# EAGLE design pH_meter (EAGLE 9.6.2)

## Sheet 1 of 2
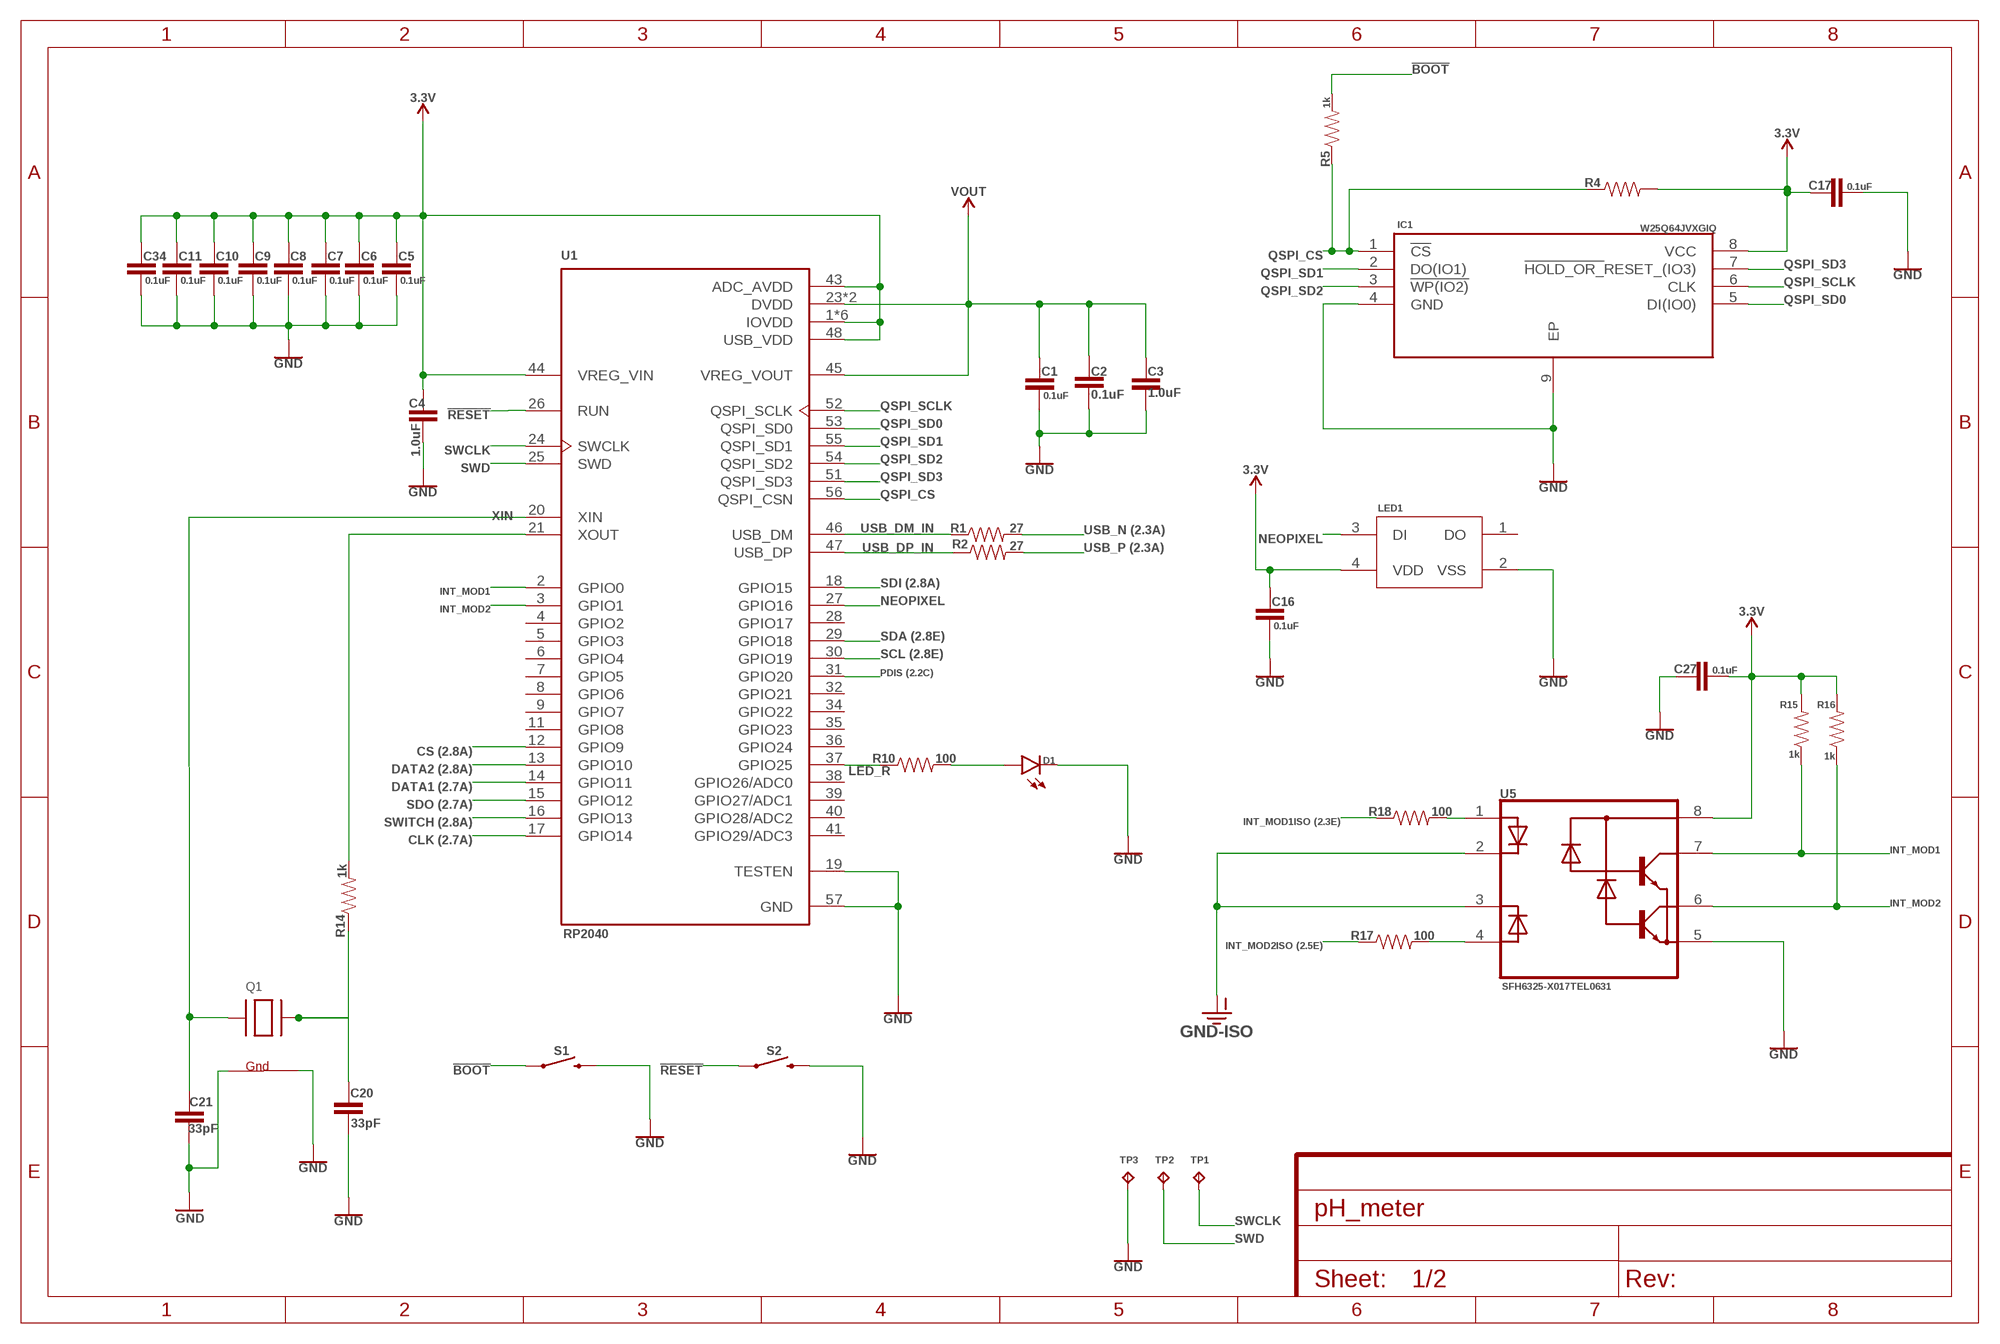
[diagram p0: schematic, sheet 1]

### Parts
C1  0.1uF  0.1UF-0603-25V-(+80/-20%)  [0603]
C2  0.1uF  0.1UF-0603-25V-(+80/-20%)  [0603]
C3  1.0uF  1.0UF-0603-16V-10%  [0603]
C4  1.0uF  1.0UF-0603-16V-10%  [0603]
C5  0.1uF  0.1UF-0603-25V-(+80/-20%)  [0603]
C6  0.1uF  0.1UF-0603-25V-(+80/-20%)  [0603]
C7  0.1uF  0.1UF-0603-25V-(+80/-20%)  [0603]
C8  0.1uF  0.1UF-0603-25V-(+80/-20%)  [0603]
C9  0.1uF  0.1UF-0603-25V-(+80/-20%)  [0603]
C10  0.1uF  0.1UF-0603-25V-(+80/-20%)  [0603]
C11  0.1uF  0.1UF-0603-25V-(+80/-20%)  [0603]
C16  0.1uF  0.1UF-0603-25V-(+80/-20%)  [0603]
C17  0.1uF  0.1UF-0603-25V-(+80/-20%)  [0603]
C20  33pF  33PF-0603-50V-5%  [0603]
C21  33pF  33PF-0603-50V-5%  [0603]
C27  0.1uF  0.1UF-0603-25V-(+80/-20%)  [0603]
C34  0.1uF  0.1UF-0603-25V-(+80/-20%)  [0603]
D1  LED0603  [LED-0603]
IC1  W25Q64JVXGIQ  [SON80P400X400X50-9N]
LED1  WS2812B-2020  [WS2812B-2020]
Q1  XTAL-4-3225  [NX3225]
R1  27  27OHM-0603-1/10W-1%  [0603]
R2  27  27OHM-0603-1/10W-1%  [0603]
R4  RESISTOR0603  [0603]
R5  1k  1KOHM-0603-1/10W-1%  [0603]
R10  100  100OHM-0603-1/10W-1%  [0603]
R14  1k  1KOHM-0603-1/10W-1%  [0603]
R15  1k  1KOHM-0603-1/10W-1%  [0603]
R16  1k  1KOHM-0603-1/10W-1%  [0603]
R17  100  100OHM-0603-1/10W-1%  [0603]
R18  100  100OHM-0603-1/10W-1%  [0603]
S1  MOMENTARY-SWITCH-SPST-SMD-4.6X2.8MM  [TACTILE_SWITCH_SMD_4.6X2.8MM]
S2  MOMENTARY-SWITCH-SPST-SMD-4.6X2.8MM  [TACTILE_SWITCH_SMD_4.6X2.8MM]
TP1  TPB2,54  [B2,54]
TP2  TPB2,54  [B2,54]
TP3  TPB2,54  [B2,54]
U1  RP2040  [QFN40P700X700X90-57N]
U5  SFH6325-X017TEL0631  [SOIC127P599X175-8N]

### Nets
3.3V: C4.1 C5.1 C6.1 C7.1 C8.1 C9.1 C10.1 C11.1 C16.1 C17.1 C27.2 C34.1 IC1.8(VCC) LED1.4(VDD) R4.2 R15.2 R16.2 U1.1(IOVDD) U1.10(IOVDD) U1.22(IOVDD) U1.33(IOVDD) U1.42(IOVDD) U1.43(ADC_AVDD) U1.44(VREG_VIN) U1.48(USB_VDD) U1.49(IOVDD) U5.8(C(VCC)) ; also sheet 2
!BOOT: R5.2 S1.1 S1.2
!RESET: S2.1 S2.2 U1.26(RUN)
CLK: U1.17(GPIO14) ; also sheet 2
CS: U1.12(GPIO9) ; also sheet 2
DATA1: U1.14(GPIO11) ; also sheet 2
DATA2: U1.13(GPIO10) ; also sheet 2
GND: C1.2 C2.2 C3.2 C4.2 C5.2 C6.2 C7.2 C8.2 C9.2 C10.2 C11.2 C16.2 C17.2 C20.1 C21.1 C27.1 C34.2 D1.C IC1.4(GND) IC1.9(EP) LED1.2(VSS) Q1.2(G2) Q1.4(G1) S1.3 S1.4 S2.3 S2.4 TP3.TP U1.19(TESTEN) U1.57(GND) U5.5(E(GND)) ; also sheet 2
GND-ISO: U5.2(C1) U5.3(C2) ; also sheet 2
INT_MOD1: R15.1 U1.2(GPIO0) U5.7(C1(VO1))
INT_MOD1ISO: R18.1 ; also sheet 2
INT_MOD2: R16.1 U1.3(GPIO1) U5.6(C2(VO2))
INT_MOD2ISO: R17.1 ; also sheet 2
LED_R: R10.1 U1.37(GPIO25)
N$1: D1.A R10.2
N$4: C20.2 Q1.3(X2) R14.1
N$6: R14.2 U1.21(XOUT)
N$7: R17.2 U5.4(A2)
N$8: R18.2 U5.1(A1)
NEOPIXEL: LED1.3(DI) U1.27(GPIO16)
PDIS: U1.31(GPIO20) ; also sheet 2
QSPI_CS: IC1.1(!CS) R4.1 R5.1 U1.56(QSPI_CSN)
QSPI_SCLK: IC1.6(CLK) U1.52(QSPI_SCLK)
QSPI_SD0: IC1.5(DI(IO0)) U1.53(QSPI_SD0)
QSPI_SD1: IC1.2(DO(IO1)) U1.55(QSPI_SD1)
QSPI_SD2: IC1.3(!WP(IO2)) U1.54(QSPI_SD2)
QSPI_SD3: IC1.7(!HOLD_OR_!RESET_(IO3)) U1.51(QSPI_SD3)
SCL: U1.30(GPIO19) ; also sheet 2
SDA: U1.29(GPIO18) ; also sheet 2
SDI: U1.18(GPIO15) ; also sheet 2
SDO: U1.15(GPIO12) ; also sheet 2
SWCLK: TP1.TP U1.24(SWCLK)
SWD: TP2.TP U1.25(SWD)
SWITCH: U1.16(GPIO13) ; also sheet 2
USB_DM_IN [USB]: R1.1 U1.46(USB_DM)
USB_DP_IN [USB]: R2.1 U1.47(USB_DP)
USB_N [USB]: R1.2 ; also sheet 2
USB_P [USB]: R2.2 ; also sheet 2
VOUT: C1.1 C2.1 C3.1 U1.23(DVDD) U1.45(VREG_VOUT) U1.50(DVDD)
XIN: C21.2 Q1.1(X1) U1.20(XIN)
Unconnected: LED1.1(DO) U1.4(GPIO2) U1.5(GPIO3) U1.6(GPIO4) U1.7(GPIO5) U1.8(GPIO6) U1.9(GPIO7) U1.11(GPIO8) U1.28(GPIO17) U1.32(GPIO21) U1.34(GPIO22) U1.35(GPIO23) U1.36(GPIO24) U1.38(GPIO26/ADC0) U1.39(GPIO27/ADC1) U1.40(GPIO28/ADC2) U1.41(GPIO29/ADC3)

## Sheet 2 of 2
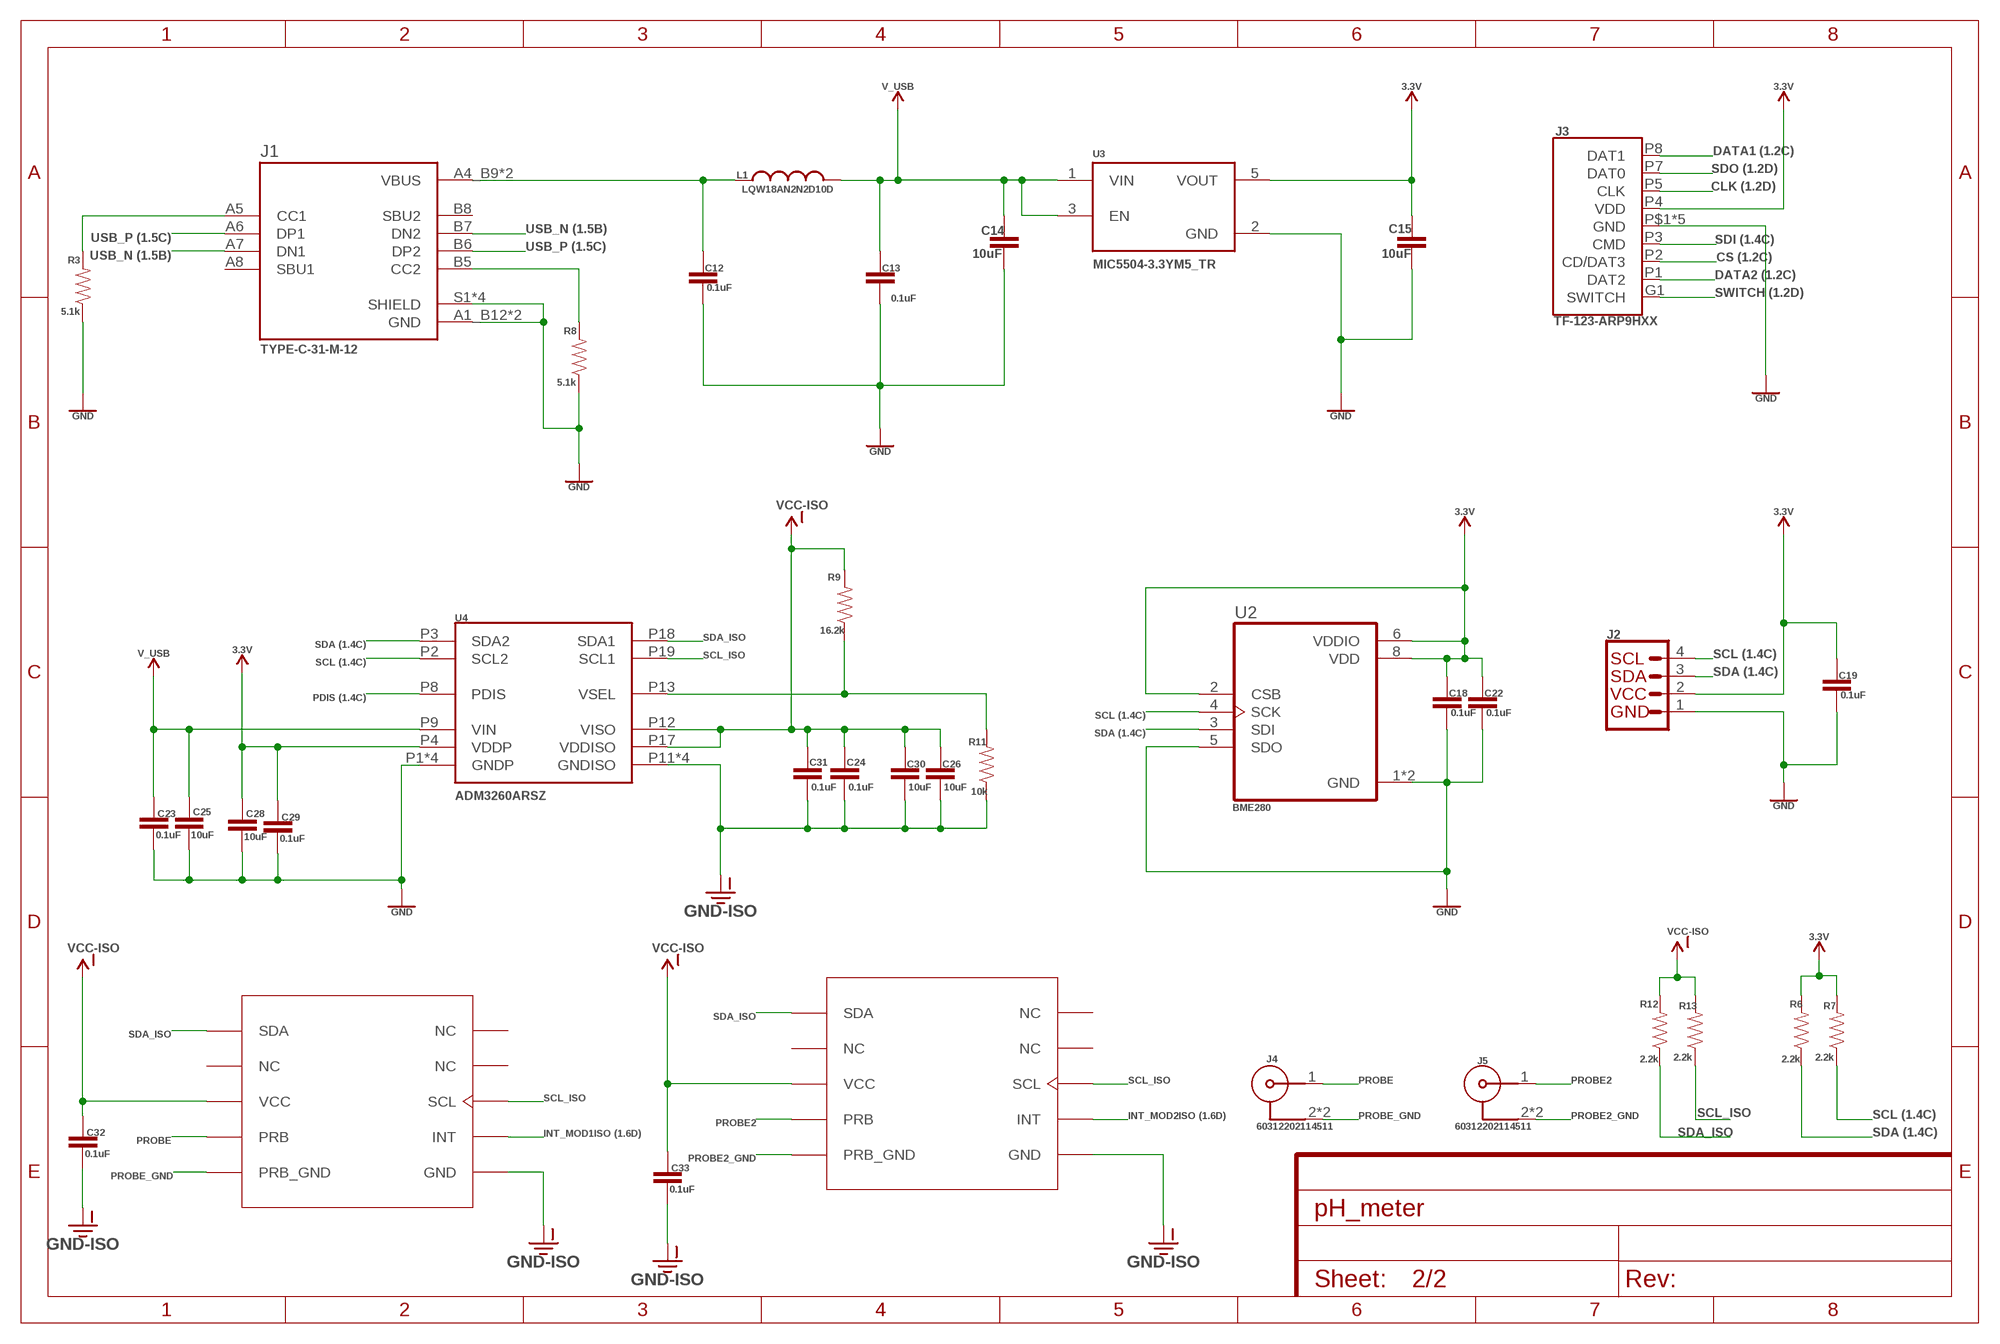
[diagram p1: schematic, sheet 2]

### Parts
C12  0.1uF  0.1UF-0603-25V-(+80/-20%)  [0603]
C13  0.1uF  0.1UF-0603-25V-(+80/-20%)  [0603]
C14  10uF  10UF-0603-6.3V-20%  [0603]
C15  10uF  10UF-0603-6.3V-20%  [0603]
C18  0.1uF  0.1UF-0603-25V-5%  [0603]
C19  0.1uF  0.1UF-0603-25V-5%  [0603]
C22  0.1uF  0.1UF-0603-25V-5%  [0603]
C23  0.1uF  0.1UF-0603-25V-5%  [0603]
C24  0.1uF  0.1UF-0603-50V-10%-X7R-WE  [0603]
C25  10uF  10UF-0603-6.3V-20%  [0603]
C26  10uF  10UF-0603-6.3V-20%  [0603]
C28  10uF  10UF-0603-6.3V-20%  [0603]
C29  0.1uF  0.1UF-0603-25V-5%  [0603]
C30  10uF  10UF-0603-6.3V-20%  [0603]
C31  0.1uF  0.1UF-0603-50V-10%-X7R-WE  [0603]
C32  0.1uF  0.1UF-0603-25V-5%  [0603]
C33  0.1uF  0.1UF-0603-25V-5%  [0603]
J1  TYPE-C-31-M-12  [HRO_TYPE-C-31-M-12]
J2  QWIIC_CONNECTORJS-1MM  [1X04_1MM_RA]
J3  TF-123-ARP9HXX  [MICROSDCARD]
J4  60312202114511  [60312202114511]
J5  60312202114511  [60312202114511]
L1  LQW18AN2N2D10D  [INDC1608X100N]
R3  5.1k  5.1KOHM5.1KOHM-0603-1/10W-1%  [0603]
R6  2.2k  2.2KOHM-0603-1/10W-1%  [0603]
R7  2.2k  2.2KOHM-0603-1/10W-1%  [0603]
R8  5.1k  5.1KOHM5.1KOHM-0603-1/10W-1%  [0603]
R9  16.2k  16.2KOHM-0603-1/10W-1%  [0603]
R11  10k  10KOHM-0603-1/10W-1%  [0603]
R12  2.2k  2.2KOHM-0603-1/10W-1%  [0603]
R13  2.2k  2.2KOHM-0603-1/10W-1%  [0603]
U2  BME280  [PSON65P250X250X100-8N]
U3  MIC5504-3.3YM5_TR  [SOT95P280X145-5N]
U4  ADM3260ARSZ  [SSOP20]
U$1  PH-OEM  [PH_SENSOR]
U$2  PH-OEM  [PH_SENSOR]

### Nets
3.3V: C15.2 C18.1 C19.1 C22.1 C28.1 C29.1 J2.2 J3.P4(VDD) R6.2 R7.2 U2.2(CSB) U2.6(VDDIO) U2.8(VDD) U3.5(VOUT) U4.P4(VDDP) ; also sheet 1
CLK: J3.P5(CLK) ; also sheet 1
CS: J3.P2(CD/DAT3) ; also sheet 1
DATA1: J3.P8(DAT1) ; also sheet 1
DATA2: J3.P1(DAT2) ; also sheet 1
GND: C12.2 C13.2 C14.1 C15.1 C18.2 C19.2 C22.2 C23.2 C25.2 C28.2 C29.2 J1.A1_B12(GND) J1.B1_A12(GND) J1.S1(SHIELD) J1.S2(SHIELD) J1.S3(SHIELD) J1.S4(SHIELD) J2.1 J3.P6(GND) J3.P$1(GND) J3.P$2(GND) J3.P$3(GND) J3.P$4(GND) R3.1 R8.1 U2.1(GND) U2.5(SDO) U2.7(GND) U3.2(GND) U4.P1(GNDP) U4.P5(GNDP) U4.P7(GNDP) U4.P10(GNDP) ; also sheet 1
GND-ISO: C24.2 C26.2 C30.2 C31.2 C32.2 C33.2 R11.1 U4.P11(GNDISO) U4.P14(GNDISO) U4.P16(GNDISO) U4.P20(GNDISO) U$1.P$6(GND) U$2.P$6(GND) ; also sheet 1
INT_MOD1ISO: U$2.P$7(INT) ; also sheet 1
INT_MOD2ISO: U$1.P$7(INT) ; also sheet 1
N$2: R9.1 R11.2 U4.P13(VSEL)
N$3: J1.A5(CC1) R3.2
N$5: J1.B5(CC2) R8.2
N$9: C12.1 J1.A4_B9(VBUS) J1.B4_A9(VBUS) L1.1
PDIS: U4.P8(PDIS) ; also sheet 1
PROBE: J4.1 U$2.P$4(PRB)
PROBE2: J5.1 U$1.P$4(PRB)
PROBE2_GND: J5.2 J5.3 U$1.P$5(PRB_GND)
PROBE_GND: J4.2 J4.3 U$2.P$5(PRB_GND)
SCL: J2.4 R7.1 U2.4(SCK) U4.P2(SCL2) ; also sheet 1
SCL_ISO: R13.1 U4.P19(SCL1) U$1.P$8(SCL) U$2.P$8(SCL)
SDA: J2.3 R6.1 U2.3(SDI) U4.P3(SDA2) ; also sheet 1
SDA_ISO: R12.1 U4.P18(SDA1) U$1.P$1(SDA) U$2.P$1(SDA)
SDI: J3.P3(CMD) ; also sheet 1
SDO: J3.P7(DAT0) ; also sheet 1
SWITCH: J3.G1(SWITCH) ; also sheet 1
USB_N [USB]: J1.A7(DN1) J1.B7(DN2) ; also sheet 1
USB_P [USB]: J1.A6(DP1) J1.B6(DP2) ; also sheet 1
V_USB: C13.1 C14.2 C23.1 C25.1 L1.2 U3.1(VIN) U3.3(EN) U4.P9(VIN)
VCC-ISO: C24.1 C26.1 C30.1 C31.1 C32.1 C33.1 R9.2 R12.2 R13.2 U4.P12(VISO) U4.P17(VDDISO) U$1.P$3(VCC) U$2.P$3(VCC)
Unconnected: J1.A8(SBU1) J1.B8(SBU2) U$1.P$2(NC) U$1.P$9(NC) U$1.P$10(NC) U$2.P$2(NC) U$2.P$9(NC) U$2.P$10(NC)

## Library data of the parts
C1 C2 C5-C13 C16 C17 C27 C34 = SparkFun-Capacitors:0.1UF: 0.1µF ceramic capacitors A capacitor is a passive two-terminal electrical component used to store electrical energy temporarily in an electric field.; PROD_ID: CAP-00810
C3 C4 = SparkFun-Capacitors:1.0UF: 1µF ceramic capacitors A capacitor is a passive two-terminal electrical component used to store electrical energy temporarily in an electric field.; PROD_ID: CAP-00868
C14 C15 C25 C26 C28 C30 = SparkFun-Capacitors:10UF: 10.0µF ceramic capacitors A capacitor is a passive two-terminal electrical component used to store electrical energy temporarily in an electric field.; PROD_ID: CAP-11015
C18 C19 C22 C23 C29 C32 C33 = SparkFun-Capacitors:0.1UF: 0.1µF ceramic capacitors A capacitor is a passive two-terminal electrical component used to store electrical energy temporarily in an electric field.; PROD_ID: CAP-08604
C20 C21 = SparkFun-Capacitors:33PF: 33pF ceramic capacitors A capacitor is a passive two-terminal electrical component used to store electrical energy temporarily in an electric field.; PROD_ID: CAP-10142
C24 C31 = SparkFun-Capacitors:0.1UF: 0.1µF ceramic capacitors A capacitor is a passive two-terminal electrical component used to store electrical energy temporarily in an electric field.; PROD_ID: CAP-16523
D1 = SparkFun-LED:LED: LED (Generic) Standard schematic elements and footprints for 5mm, 3mm, 1206, and 0603 sized LEDs. Generic LEDs with no color specified.
IC1 = SamacSys_Parts:W25Q64JVXGIQ: 64M-bit Serial Flash Memory with uniform 4KB sectors and Dual/Quad SPI Source: Datasheet <https://www.winbond.com/hq/search-resource-file.jsp?partNo=W25Q64JVXGIQ&type=datasheet>; DESCRIPTION: 64M-bit Serial Flash Memory with uniform 4KB sectors and Dual/Quad SPI; HEIGHT: 0.5mm; MANUFACTURER_NAME: Winbond; MANUFACTURER_PART_NUMBER: W25Q64JVXGIQ
J1 = TYPE-C-31-M-12:TYPE-C-31-M-12: Check availability <https://pricing.snapeda.com/parts/TYPE-C-31-M-12/HRO%20Electronics%20Co.%2C%20Ltd./view-part?ref=eda>; AVAILABILITY: Not in stock; CHECK_PRICES: https://www.snapeda.com/parts/TYPE-C-31-M-12/HRO+Electronics+Co.%252C+Ltd./view-part/?ref=eda; DESCRIPTION: USB Connectors 24 Receptacle 1 8.94*7.3mm RoHS; MF: HRO Electronics Co., Ltd.; MP: TYPE-C-31-M-12; PACKAGE: Package; PRICE: None; SNAPEDA_LINK: https://www.snapeda.com/parts/TYPE-C-31-M-12/HRO+Electronics+Co.%252C+Ltd./view-part/?ref=snap
J2 = SparkFun-Connectors:QWIIC_CONNECTOR: SparkFun I2C Standard Qwiic Connector An SMD 1mm pitch JST connector makes it easy and quick (get it? Qwiic?) to connect I2C devices to each other. The Qwiic system <http://www.sparkfun.com/qwiic> enables fast and solderless connection between popular platforms and various sensors and actuators. We carry 200mm <https://www.sparkfun.com/products/14204>, 100mm <https://www.sparkfun.com/products/14205>, 50mm <https://www.sparkfun.com/products/14206>, and breadboard friendly <https://www.sparkfun.com/products/14207> Qwiic cables. We also offer 10 pcs strips <https://www.sparkfun.com/products/14323> the SMD connectors.; PROD_ID: CONN-13694
J3 = xunpu_tf123:TF-123-ARP9HXX
J4 J5 = 60312202114511:60312202114511: WR-SMA PCB End Launch Characteristics Interface: MIL-STD-348 Mating Cycle: 500 Cycles Impedance: 50Ω Insulation Resistance: 5000MΩ(min.) Withstanding Voltage: 1000Vrms(min.) Ingress Protection: None l IP67 Mating: Screw (Recommended by torque wrench tool) Applications Network and communications RF Test and measurement equipment Industrial applications Electronic consumers and device Outdoor or humid environment <https://www.we-online.com/components/media/o122886v209%20Family-WR-SMA%20End%20Launch%20Connectors.jpg> Details see: www.we-online.com/components/products/COAX_SMA_CONNECTOR_PCB_END_LAUNCH <www.we-online.com/catalog/COAX_SMA_CONNECTOR_PCB_END_LAUNCH/?utm_source=eagle_model&utm_medium=description_link&utm_campaign=eisos_eagle> Updated by Ella Wu 2023-10-10 2023(C) Würth Elektronik Check availability <https://pricing.snapeda.com/parts/60312202114511/Wurth%20Electronics/view-part?ref=eda>; AVAILABILITY: In Stock; CHECK_PRICES: https://www.snapeda.com/parts/60312202114511/Wurth+Electronics+Inc./view-part/?ref=eda; DESCRIPTION: SMA Connector Jack, Female Socket 50Ohm Board Edge, End Launch; Through Hole, Right Angle Solder; MF: Wurth Electronics; MP: 60312202114511; PACKAGE: None; PRICE: None; PURCHASE-URL: https://www.snapeda.com/api/url_track_click_mouser/?unipart_id=3995265&manufacturer=Wurth Electronics&part_name=60312202114511&search_term=60312202114511; SNAPEDA_LINK: https://www.snapeda.com/parts/60312202114511/Wurth+Electronics+Inc./view-part/?ref=snap
L1 = LQW18AN2N2D10D:LQW18AN2N2D10D: Inductor RF Chip Unshielded Wirewound 2.2nH 0.5nH 100MHz 25Q-Factor Ceramic 1.4A 18mOhm DCR 0603 T/R Check availability <https://pricing.snapeda.com/parts/LQW18AN2N2D10D/Murata/view-part?ref=eda>; AVAILABILITY: In Stock; CHECK_PRICES: https://www.snapeda.com/parts/LQW18AN2N2D10D/Murata/view-part/?ref=eda; DESCRIPTION: Inductor with Inductance: 2.2nH Tol. +/-0.5nH, Package: 0603 (1608); MF: Murata; MP: LQW18AN2N2D10D; PACKAGE: 1608 Murata; PRICE: None; PURCHASE-URL: https://www.snapeda.com/api/url_track_click_mouser/?unipart_id=1503005&manufacturer=Murata&part_name=LQW18AN2N2D10D&search_term=2.2nh 0603; SNAPEDA_LINK: https://www.snapeda.com/parts/LQW18AN2N2D10D/Murata/view-part/?ref=snap
LED1 = WS2812B-2020:WS2812B-2020: A small 2x2mm addressable RGB led Check availability <https://pricing.snapeda.com/parts/WS2812B-2020/WorldSemi/view-part?ref=eda>; AVAILABILITY: Not in stock; DESCRIPTION: Programmable LED; SMD; 2020; RGB; 2x2x0.84mm; 3.7÷5.3V; 2kHz; MF: WorldSemi; MP: WS2812B-2020; PACKAGE: None; PRICE: None
Q1 = adafruit:XTAL-4: Classic 4-pin 3.2 x 2.5mm crystal
R1 R2 = SparkFun-Resistors:27OHM: 27Ω resistor A resistor is a passive two-terminal electrical component that implements electrical resistance as a circuit element. Resistors act to reduce current flow, and, at the same time, act to lower voltage levels within circuits. - Wikipedia; PROD_ID: RES-09334
R3 R8 = SparkFun-Resistors:5.1KOHM; PROD_ID: RES-12083
R4 = SparkFun-Resistors:RESISTOR: Generic Resistor Package
R5 R14-R16 = SparkFun-Resistors:1KOHM: 1kΩ resistor A resistor is a passive two-terminal electrical component that implements electrical resistance as a circuit element. Resistors act to reduce current flow, and, at the same time, act to lower voltage levels within circuits. - Wikipedia; PROD_ID: RES-07856
R6 R7 R12 R13 = SparkFun-Resistors:2.2KOHM: 2.2kΩ resistor A resistor is a passive two-terminal electrical component that implements electrical resistance as a circuit element. Resistors act to reduce current flow, and, at the same time, act to lower voltage levels within circuits. - Wikipedia; PROD_ID: RES-08272
R9 = SparkFun-Resistors:16.2KOHM: 16.2kΩ resistor A resistor is a passive two-terminal electrical component that implements electrical resistance as a circuit element. Resistors act to reduce current flow, and, at the same time, act to lower voltage levels within circuits. - Wikipedia; PROD_ID: RES-12187
R10 R17 R18 = SparkFun-Resistors:100OHM: 100Ω resistor A resistor is a passive two-terminal electrical component that implements electrical resistance as a circuit element. Resistors act to reduce current flow, and, at the same time, act to lower voltage levels within circuits. - Wikipedia; PROD_ID: RES-07863
R11 = SparkFun-Resistors:10KOHM: 10kΩ resistor A resistor is a passive two-terminal electrical component that implements electrical resistance as a circuit element. Resistors act to reduce current flow, and, at the same time, act to lower voltage levels within circuits. - Wikipedia; PROD_ID: RES-00824
S1 S2 = SparkFun-Switches:MOMENTARY-SWITCH-SPST: Momentary Switch (Pushbutton) - SPST Normally-open (NO) SPST momentary switches (buttons, pushbuttons). Variants PTH-12MM - 12mm square, through-hole Momentary Pushbutton Switch - 12mm Square <https://www.sparkfun.com/products/9190> (COM-09190) PTH-6.0MM, PTH-6.0MM-KIT - 6.0mm square, through-hole Mini Pushbutton Switch <https://www.sparkfun.com/products/97> (COM-00097) KIT package intended for soldering kit's - only one side of pads' copper is exposed. PTH-RIGHT-ANGLE-KIT - Right-angle, through-hole Right Angle Tactile Button <https://www.sparkfun.com/products/10791> - Used on SparkFun BigTime Watch Kit <https://www.sparkfun.com/products/11734> SMD-12MM - 12mm square, surface-mount Tactile Button - SMD (12mm) <https://www.sparkfun.com/products/12993> (COM-12993) Used on SparkFun PicoBoard <https://www.sparkfun.com/products/11888> SMD-4.5MM - 4.5mm Square Trackball Switch Used on SparkFun Blackberry Trackballer Breakout <https://www.sparkfun.com/products/13169> SMD-4.6MMX2.8MM - 4.60mm x 2.80mm, surface mount Used on SparkFun SAMD21 Mini Breakout <https://www.sparkfun.com/products/13664> SMD-5.2MM, SMD-5.2-REDUNDANT - 5.2mm square, surface-mount Mini Pushbutton Switch - SMD <https://www.sparkfun.com/products/8720> (COM-08720) Used on Arduino Pro Mini <https://www.sparkfun.com/products/11114> REDUNDANT package connects both switch circuits together SMD-6.0X3.5MM - 6.0 x 3.5mm, surface mount Momentary Reset Switch SMD <https://www.sparkfun.com/products/8229> (COM-08229) SMD-6.2MM-TALL - 6.2mm square, surface mount Tactile Button - SMD (6mm) <https://www.sparkfun.com/products/12992> Used on SparkFun Digital Sandbox <https://www.sparkfun.com/products/12651> SMD-RIGHT-ANGLE - Right-angle, surface mount Used on SparkFun Block for Intel® Edison - Arduino <https://www.sparkfun.com/products/13036>; PROD_ID: SWCH-13065
TP1-TP3 = testpad:TP: Test pad
U1 = RP2040:RP2040: Check availability <https://pricing.snapeda.com/parts/RP2040/Raspberry%20Pi/view-part?ref=eda>; AVAILABILITY: In Stock; DESCRIPTION: RP2040 chip for Raspberry Pi Pico - ARM® Cortex®-M0+ MCU 32-Bit; MF: Raspberry Pi; MP: RP2040; PACKAGE: None; PRICE: None; PURCHASE-URL: https://pricing.snapeda.com/search/part/RP2040/?ref=eda
U2 = BME280:BME280: DIGITAL HUMIDITY, PRESSURE AND TEMPERATURE SENSOR * Digital interface I²C (up to 3.4 MHz) and SPI (3 and 4 wire, up to 10 MHz)* Supply voltage VDD main supply voltage range: 1.71 V to 3.6 V*VDDIO interface voltage range: 1.2 V to 3.6 V Operating range -40…+85 °C, 0…100 % rel. humidity, 300…1100 hPa The library has been designed by Richard Magdycz <https://www.facebook.com/groups/eaglecadsoftUK> Check availability <https://pricing.snapeda.com/parts/BME280/Bosch/view-part?ref=eda>; AVAILABILITY: In Stock; CHECK_PRICES: https://www.snapeda.com/parts/BME280/Bosch+Sensortec/view-part/?ref=eda; DESCRIPTION: Board Mount Humidity Sensors MEMS humidity, pressure and temperature sensor; MF: Bosch; MP: BME280; PACKAGE: LGA-8 Bosch; PRICE: None; PURCHASE-URL: https://www.snapeda.com/api/url_track_click_mouser/?unipart_id=49769&manufacturer=Bosch&part_name=BME280&search_term=bme280; SNAPEDA_LINK: https://www.snapeda.com/parts/BME280/Bosch+Sensortec/view-part/?ref=snap
U3 = MIC5504-3.3YM5_TR:MIC5504-3.3YM5_TR: Linear Voltage Regulator IC 1 Output 300mA SOT-23-5 Check availability <https://pricing.snapeda.com/parts/MIC5504-3.3YM5%20TR/Microchip/view-part?ref=eda>; AVAILABILITY: In Stock; DESCRIPTION: Linear Voltage Regulator IC Positive Fixed 1 Output 300mA SOT-23-5; MF: Microchip; MP: MIC5504-3.3YM5 TR; PACKAGE: SOT-23 Microchip; PRICE: None; PURCHASE-URL: https://pricing.snapeda.com/search/part/MIC5504-3.3YM5 TR/?ref=eda
U4 = ADM3260ARSZ:ADM3260ARSZ: Check availability <https://pricing.snapeda.com/parts/ADM3260ARSZ/Analog%20Devices/view-part?ref=eda>; AVAILABILITY: In Stock; CHECK_PRICES: https://www.snapeda.com/parts/ADM3260ARSZ/Analog+Devices/view-part/?ref=eda; DESCRIPTION: Hot Swappable, Dual I2C Isolators with Integrated DC-to-DC Converter; MF: Analog Devices; MP: ADM3260ARSZ; PACKAGE: SSOP-20 Analog Devices; PRICE: None; PURCHASE-URL: https://www.snapeda.com/api/url_track_click_mouser/?unipart_id=474198&manufacturer=Analog Devices&part_name=ADM3260ARSZ&search_term=adm3260; SNAPEDA_LINK: https://www.snapeda.com/parts/ADM3260ARSZ/Analog+Devices/view-part/?ref=snap
U5 = SFH6325-X017T:SFH6325-X017T: High Speed Optocoupler, Dual Channel, 1 MBd, Transistor Output Check availability <https://pricing.snapeda.com/parts/SFH6325-X017T/Vishay%20Semiconductor/view-part?ref=eda>
U$1 U$2 = pH-OEM:PH-OEM

## Board
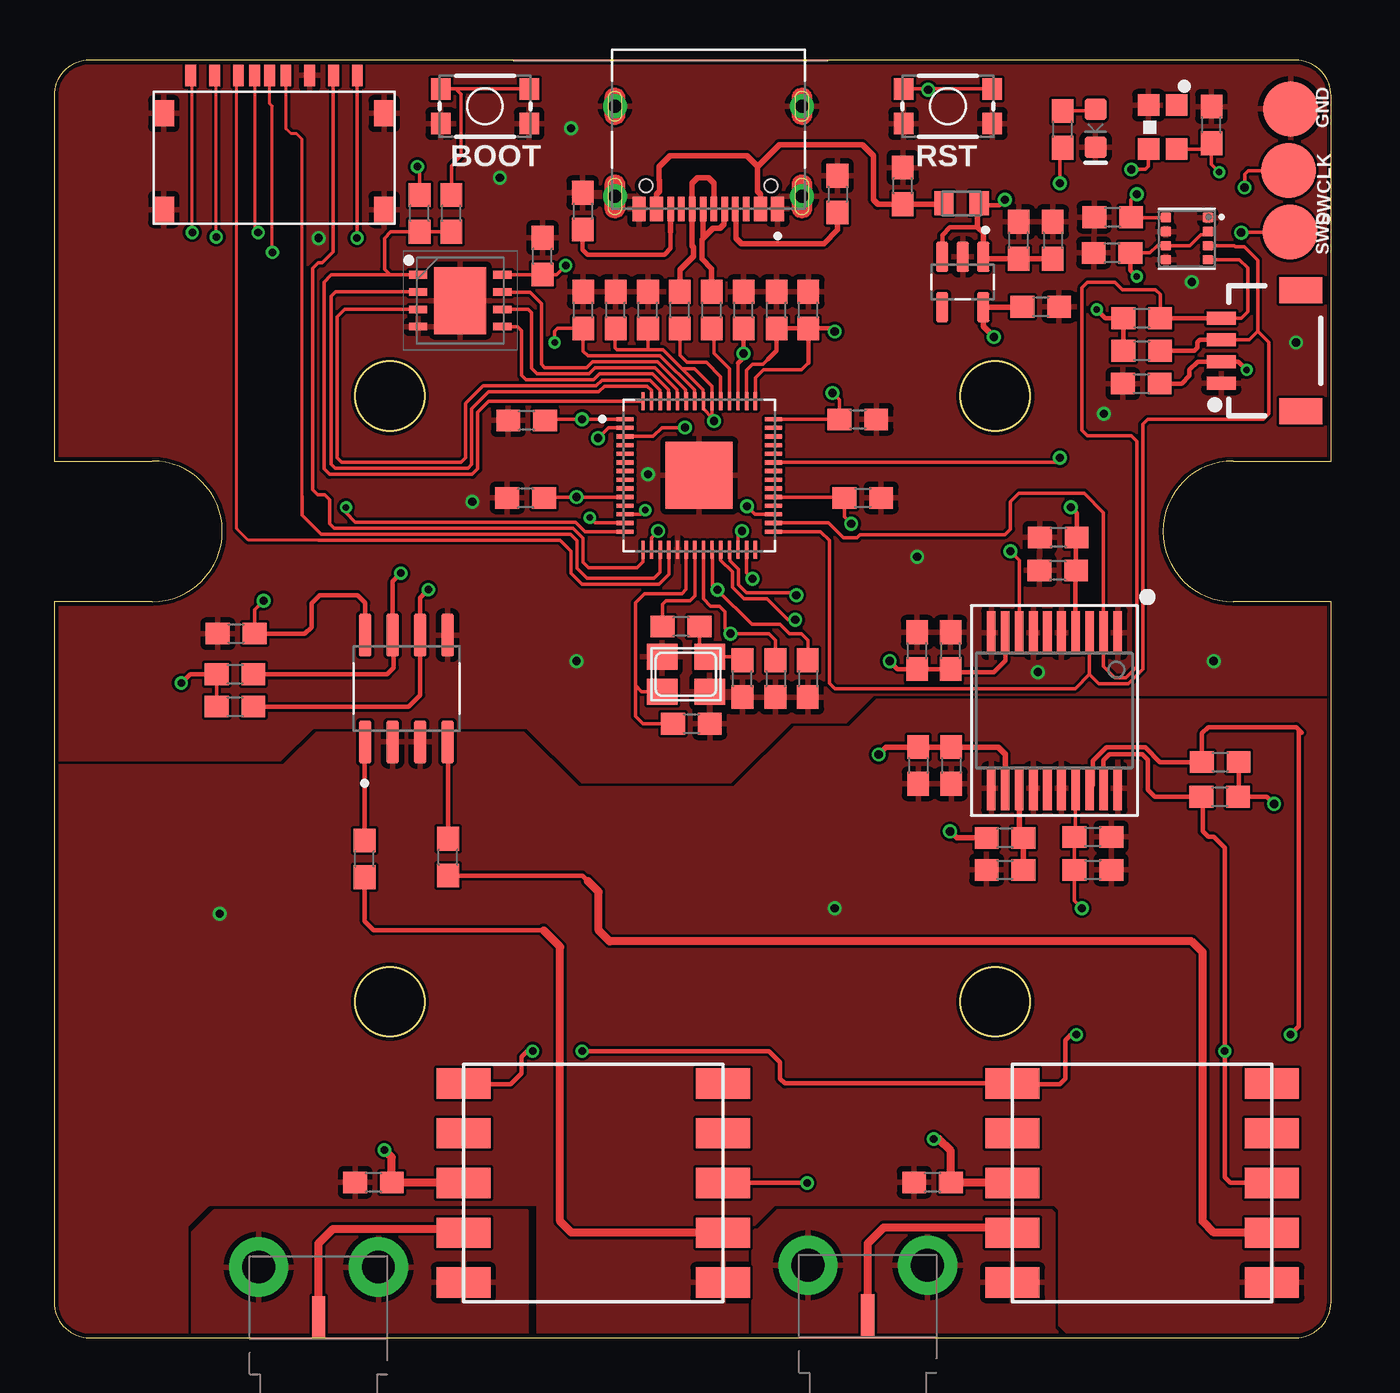
[diagram p2: board, top side]
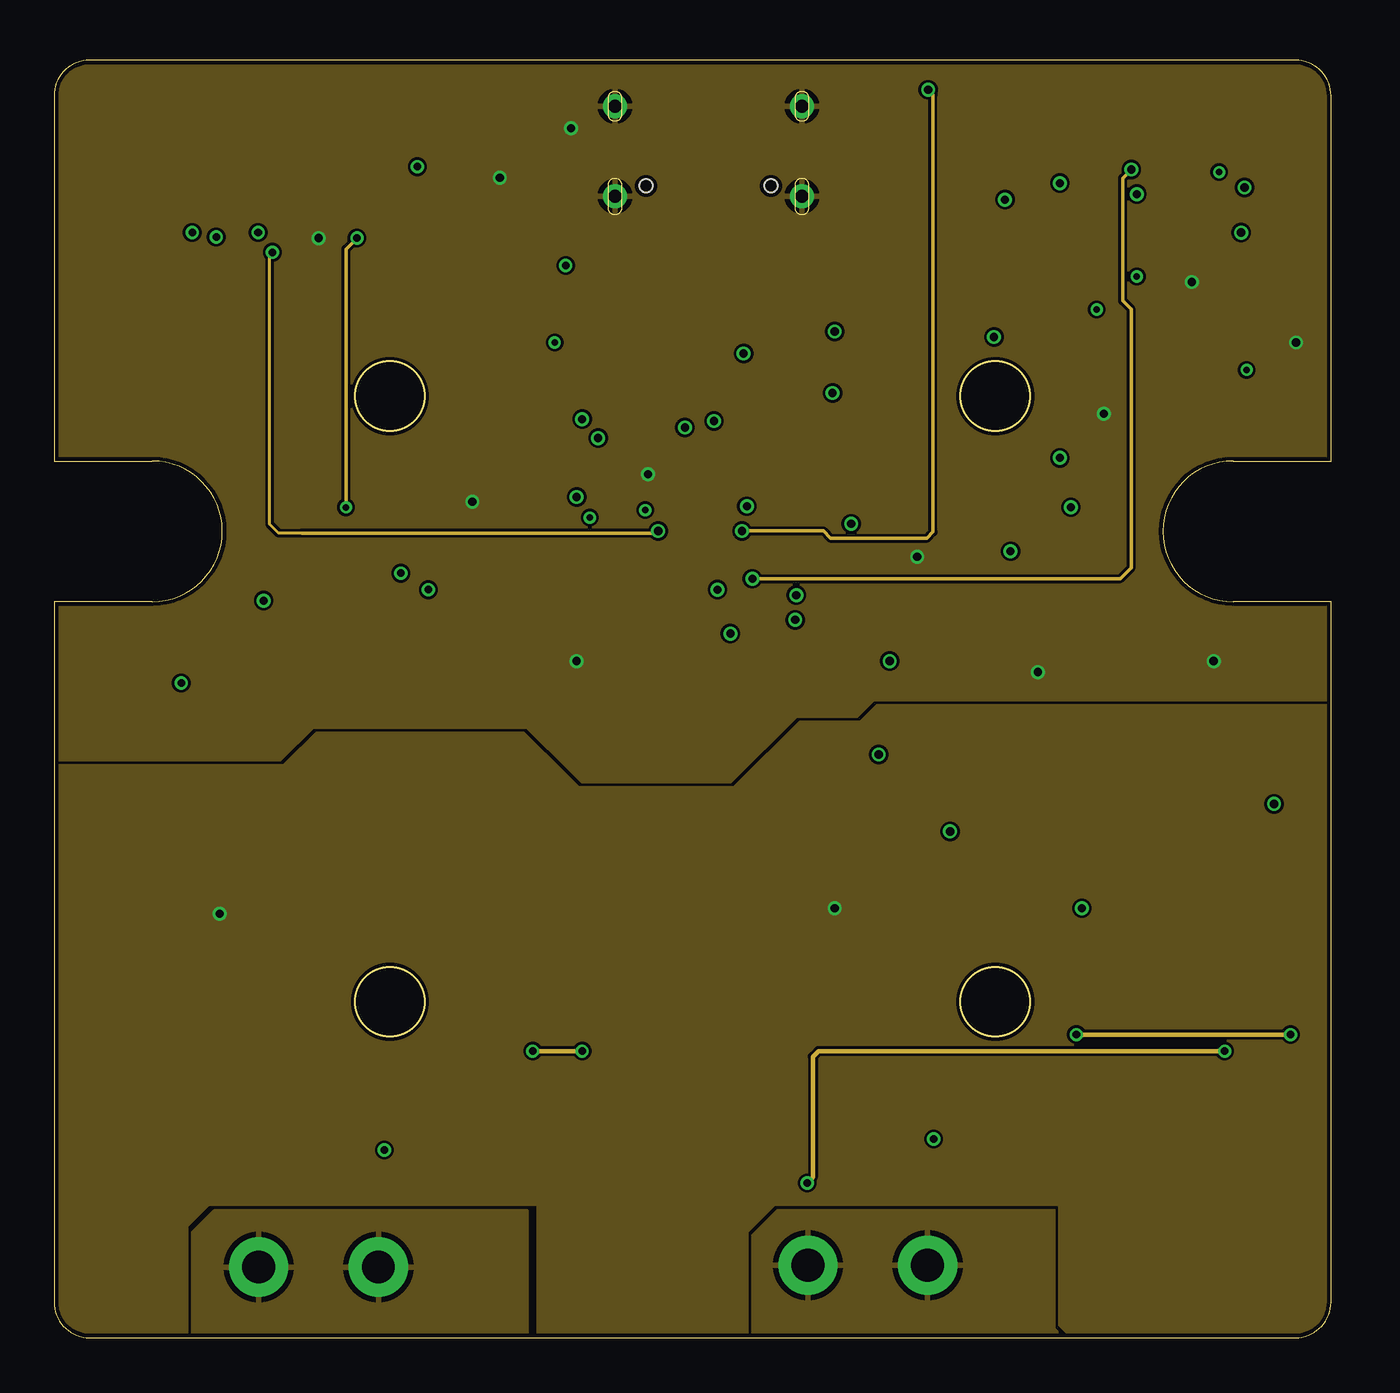
[diagram p3: board, inner layer Route2]
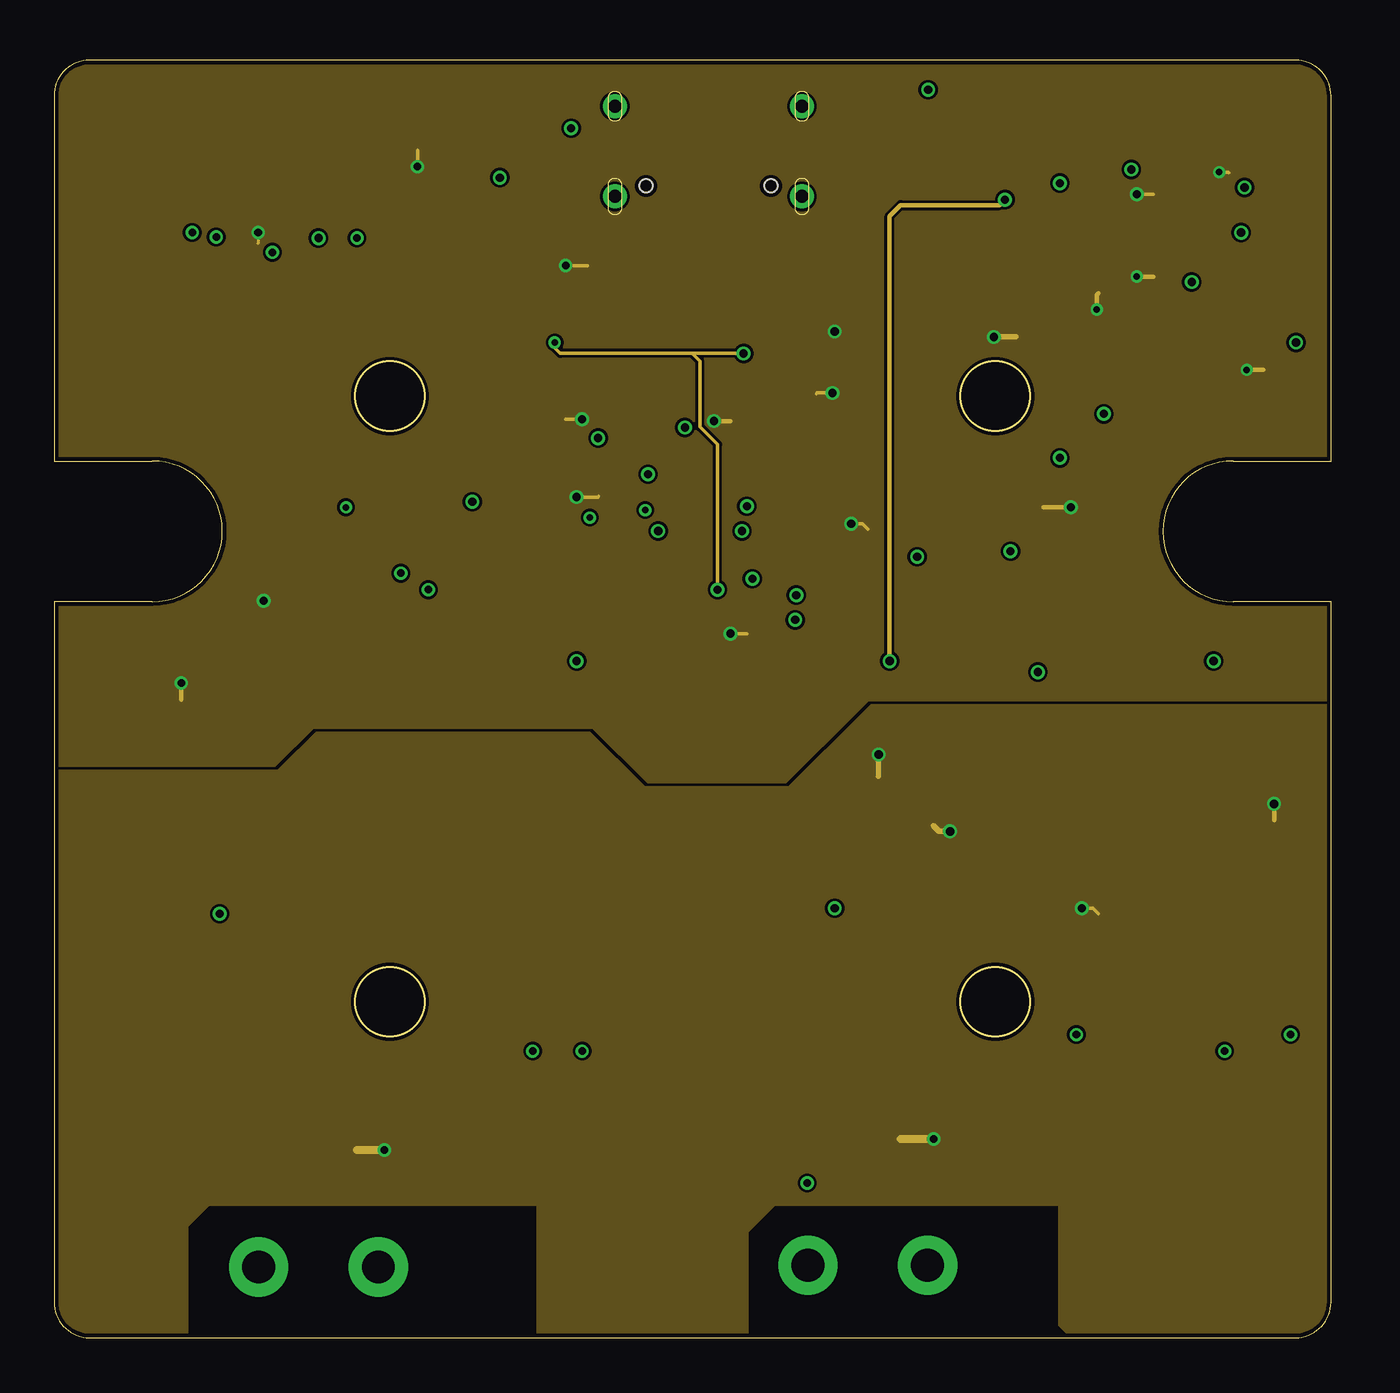
[diagram p4: board, inner layer Route15]
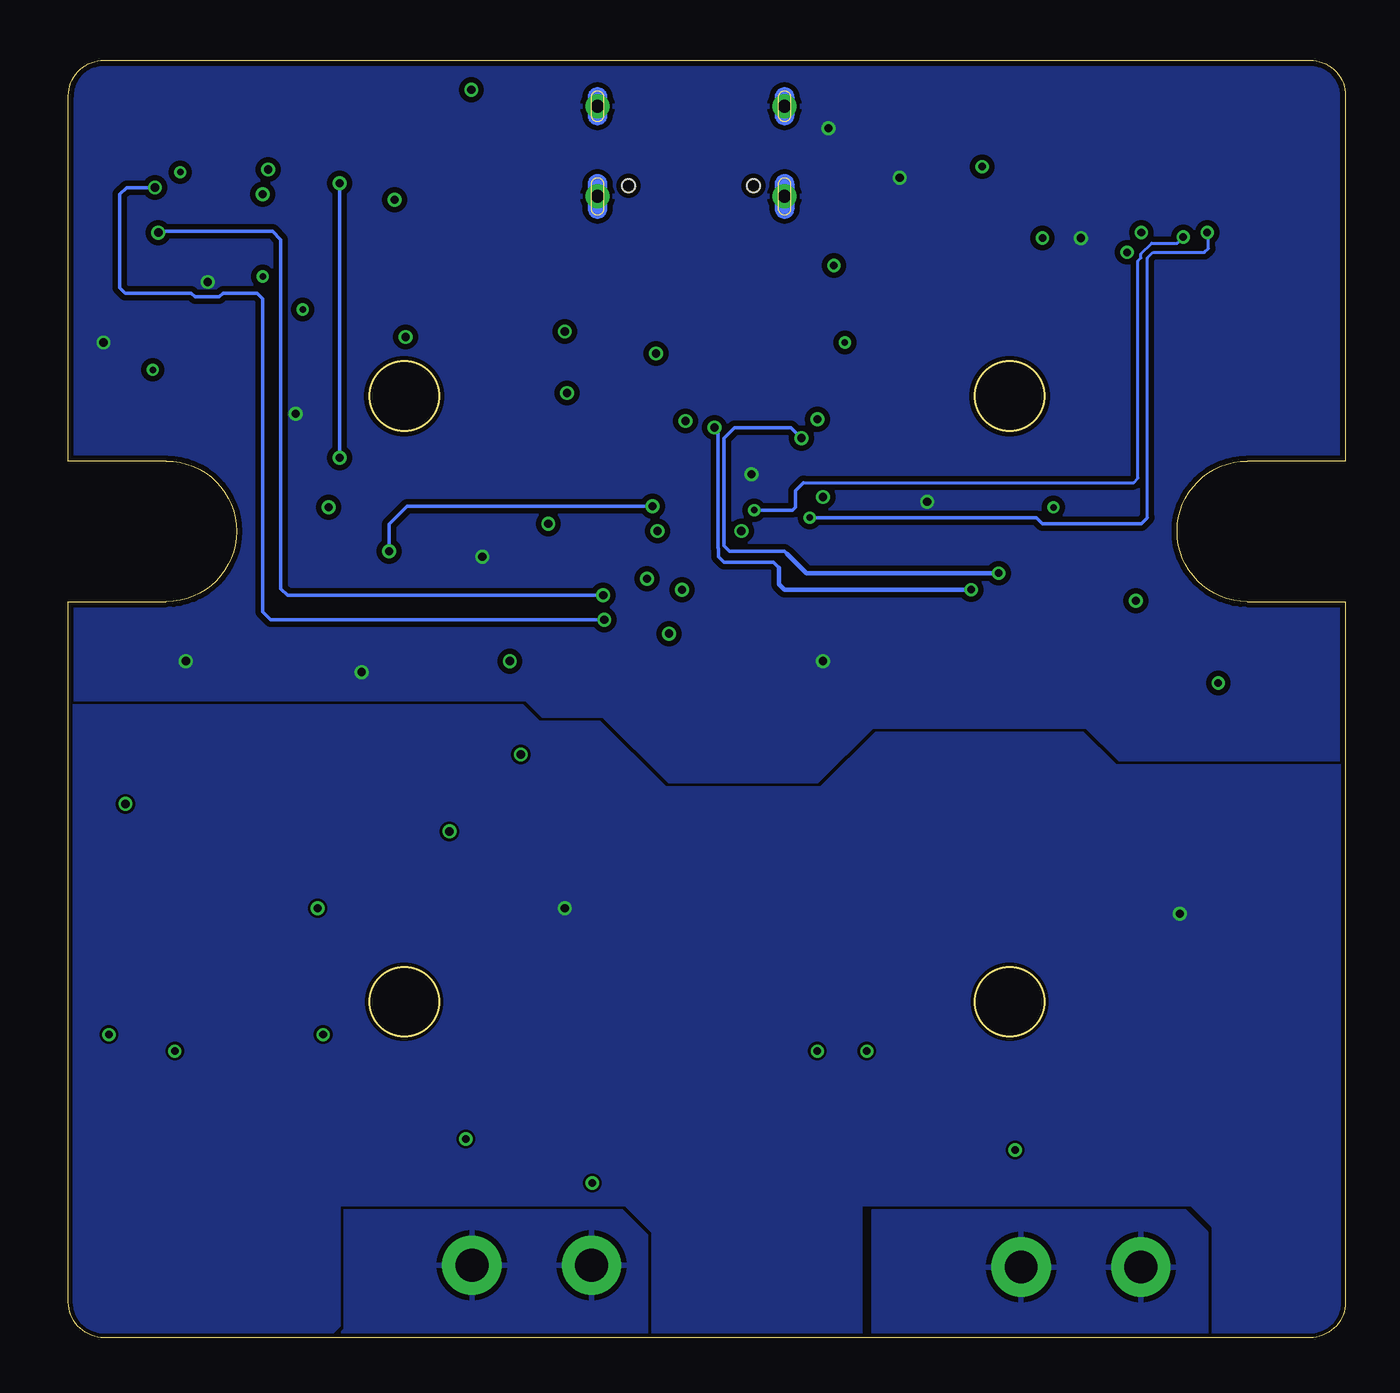
[diagram p5: board, bottom side, seen from below]

Size 59.07 x 59.07 mm. Coordinates in mm from the lower left corner, seen from the top.
Outline: 4.53,34.03 arc180 4.53,40.53 0,40.53 0,57.42 arc-90 1.65,59.07 57.42,59.07 arc-90 59.07,57.42 59.07,40.53 54.53,40.53 arc180 54.53,34.03 59.07,34.03 59.07,1.65 arc-90 57.42,0 1.65,0 arc-90 0,1.65 0,34.03 4.53,34.03
Outline: circle at 15.53,15.53 radius 1.6
Outline: circle at 43.53,15.53 radius 1.6
Outline: circle at 15.53,43.53 radius 1.6
Outline: circle at 43.53,43.53 radius 1.6
Copper layers (1+2*15+16): Top 0.035mm / dielectric 0.2mm / Route2 0.0175mm / dielectric 1.065mm / Route15 0.0175mm / dielectric 0.2mm / Bottom 0.035mm
Design rules "jlcpcb-4layers": minimum track width 3.5mil, minimum drill 0.2mm, track to track 5mil, track to pad 0.2mm, pad to pad 5mil, via to via 0.5mm, smd to smd 5mil, copper to edge 0.2mm, drill to drill 6mil, minimum pad ring 10mil, minimum via ring 0.13mm, stop-mask expansion 0.05mm, vias tented up to drill 16mil, thermal gap 10mil

### Footprints (pad centres in the part's own frame; a part is rotated, then mirrored left to right if it is on the bottom)
0603 = smd 1.1 x 1: 1 -0.85,0; 2 0.85,0
LED-0603 = smd 1 x 1: A -0.877,0; C 0.877,0
SON80P400X400X50-9N = smd 0.85 x 0.35: 1 -1.95,1.2; 2 -1.95,0.4; 3 -1.95,-0.4; 4 -1.95,-1.2; 5 1.95,-1.2; 6 1.95,-0.4; 7 1.95,0.4; 8 1.95,1.2 | smd 2.4 x 3.1: 9 0,0
HRO_TYPE-C-31-M-12 = smd 0.6 x 1.14: A1_B12 -3.2,4.75; A4_B9 -2.4,4.75; B1_A12 3.2,4.75; B4_A9 2.4,4.75 | smd 0.3 x 1.14: A5 -1.25,4.75; A6 -0.25,4.75; A7 0.25,4.75; A8 1.25,4.75; B5 1.75,4.75; B6 0.75,4.75; B7 -0.75,4.75; B8 -1.75,4.75 | drill 0.6 pad 0.9: S1 -4.325,4.17; S2 4.325,4.17; S3 -4.325,0; S4 4.325,0 | hole 0.6: -2.89,3.68; 2.89,3.68
1X04_1MM_RA = smd 0.6 x 1.35: 1 -1.5,0; 2 -0.5,0; 3 0.5,0; 4 1.5,0 | smd 1.2 x 2: NC1 2.8,-3.675; NC2 -2.8,-3.675
MICROSDCARD = smd 0.5 x 1: G1 0.2,0; P1 3.85,0; P2 2.75,0; P3 1.65,0; P4 0.9,0; P5 -0.55,0; P6 -1.65,0; P7 -2.75,0; P8 -3.85,0 | smd 0.95 x 1.2: P$1 -5.1,1.75; P$2 -5.1,6.2; P$3 5.1,6.2; P$4 5.1,1.75
60312202114511 = smd 0.61 x 1.97: 1 0,-2.325 | drill 1.52: 2 -2.77,0; 3 2.77,0
INDC1608X100N = smd 0.89 x 1.11: 1 -0.814,0; 2 0.814,0
WS2812B-2020 = smd 1 x 1: 1 1.015,-0.65; 2 1.015,0.65; 3 -1.015,0.65; 4 -1.015,-0.65
NX3225 = smd 1.4 x 1.2: 1 -1.1,-0.8; 2 1.1,-0.8; 3 1.1,0.8; 4 -1.1,0.8
TACTILE_SWITCH_SMD_4.6X2.8MM = smd 0.9 x 1: 1 -2.05,-0.8; 2 2.05,-0.8; 3 2.05,0.8; 4 -2.05,0.8
B2,54 = smd 2.54 x 2.54: TP 0,0
QFN40P700X700X90-57N = smd 0.84 x 0.2: 1 -3.435,2.6; 2 -3.435,2.2; 3 -3.435,1.8; 4 -3.435,1.4; 5 -3.435,1; 6 -3.435,0.6; 7 -3.435,0.2; 8 -3.435,-0.2; 9 -3.435,-0.6; 10 -3.435,-1; 11 -3.435,-1.4; 12 -3.435,-1.8; 13 -3.435,-2.2; 14 -3.435,-2.6; 29 3.435,-2.6; 30 3.435,-2.2; 31 3.435,-1.8; 32 3.435,-1.4; 33 3.435,-1; 34 3.435,-0.6; 35 3.435,-0.2; 36 3.435,0.2; 37 3.435,0.6; 38 3.435,1; 39 3.435,1.4; 40 3.435,1.8; 41 3.435,2.2; 42 3.435,2.6 | smd 0.2 x 0.84: 15 -2.6,-3.435; 16 -2.2,-3.435; 17 -1.8,-3.435; 18 -1.4,-3.435; 19 -1,-3.435; 20 -0.6,-3.435; 21 -0.2,-3.435; 22 0.2,-3.435; 23 0.6,-3.435; 24 1,-3.435; 25 1.4,-3.435; 26 1.8,-3.435; 27 2.2,-3.435; 28 2.6,-3.435; 43 2.6,3.435; 44 2.2,3.435; 45 1.8,3.435; 46 1.4,3.435; 47 1,3.435; 48 0.6,3.435; 49 0.2,3.435; 50 -0.2,3.435; 51 -0.6,3.435; 52 -1,3.435; 53 -1.4,3.435; 54 -1.8,3.435; 55 -2.2,3.435; 56 -2.6,3.435 | smd 3.1 x 3.1: 57 0,0
PSON65P250X250X100-8N = smd 0.49 x 0.45: 1 0.97,0.975; 2 0.97,0.325; 3 0.97,-0.325; 4 0.97,-0.975; 5 -0.97,-0.975; 6 -0.97,-0.325; 7 -0.97,0.325; 8 -0.97,0.975
SOT95P280X145-5N = smd 1.39 x 0.58: 1 -1.165,0.95; 2 -1.165,0; 3 -1.165,-0.95; 4 1.165,-0.95; 5 1.165,0.95
SSOP20 = smd 0.4 x 2: P1 -2.925,-3.6; P2 -2.275,-3.6; P3 -1.625,-3.6; P4 -0.975,-3.6; P5 -0.325,-3.6; P6 0.325,-3.6; P7 0.975,-3.6; P8 1.625,-3.6; P9 2.275,-3.6; P10 2.925,-3.6; P11 2.925,3.6; P12 2.275,3.6; P13 1.625,3.6; P14 0.975,3.6; P15 0.325,3.6; P16 -0.325,3.6; P17 -0.975,3.6; P18 -1.625,3.6; P19 -2.275,3.6; P20 -2.925,3.6
SOIC127P599X175-8N = smd 1.97 x 0.6: 1 -2.47,1.905; 2 -2.47,0.635; 3 -2.47,-0.635; 4 -2.47,-1.905; 5 2.47,-1.905; 6 2.47,-0.635; 7 2.47,0.635; 8 2.47,1.905
PH_SENSOR = smd 2.5 x 1.4: P$1 -6,4.6; P$2 -6,2.3; P$3 -6,0; P$4 -6,-2.3; P$5 -6,-4.6; P$6 6,-4.6; P$7 6,-2.3; P$8 6,0; P$9 6,2.3; P$10 6,4.6

### Placement (x,y rotation side)
C1  31.89,47.51 90 top
C2  34.86,30.47 270 top
C3  24.48,47.51 90 top
C4  33.42,47.51 90 top
C5  37.4,38.83 0 top
C6  21.86,42.41 180 top
C7  25.97,47.51 90 top
C8  27.47,47.51 90 top
C9  33.37,30.47 270 top
C10  34.89,47.51 90 top
C11  37.18,42.46 0 top
C12  39.26,53.25 90 top
C13  44.62,50.74 90 top
C14  46.19,50.74 270 top
C15  45.63,47.67 180 top
C16  53.53,56.07 90 top
C17  22.6,50 90 top
C18  48.96,51.81 180 top
C19  50.28,44.11 180 top
C20  31.84,30.47 90 top
C21  29.48,28.39 180 top
C22  48.94,50.16 180 top
C23  41.47,31.77 90 top
C24  41.49,26.46 270 top
C25  39.92,31.77 90 top
C26  48.05,21.63 0 top
C27  8.42,32.55 0 top
C28  46.42,35.47 180 top
C29  46.45,37 180 top
C30  48.05,23.16 0 top
C31  39.97,26.46 270 top
C32  14.77,7.18 180 top
C33  40.63,7.18 180 top
C34  21.81,38.83 180 top
D1  48.17,55.92 270 top
IC1  18.79,47.95 0 top
J1  30.27,56.94 180 top
J2  53.99,45.63 90 top
J3  10.18,58.36 180 top
J4  12.23,3.27 0 top
J5  37.63,3.34 0 top
L1  41.98,52.44 0 top
LED1  51.27,55.97 90 top
Q1  29.23,30.67 0 top
R1  30.42,47.51 90 top
R2  28.95,47.51 90 top
R3  36.24,52.87 270 top
R4  16.91,51.98 90 top
R5  18.38,51.98 90 top
R6  50.31,45.63 180 top
R7  50.31,47.13 180 top
R8  24.45,52.09 270 top
R9  43.98,23.1 180 top
R10  46.65,55.87 90 top
R11  43.98,21.63 0 top
R12  53.94,26.61 0 top
R13  53.91,25.01 0 top
R14  29,32.88 180 top
R15  8.37,30.67 180 top
R16  8.37,29.17 180 top
R17  18.23,22.22 90 top
R18  14.37,22.14 90 top
S1  19.93,56.94 180 top
S2  41.34,56.94 180 top
TP1  57.09,53.97 0 top
TP2  57.17,51.12 0 top
TP3  57.19,56.81 0 top
U1  29.84,39.87 0 top
U2  52.39,50.82 0 top
U3  42.03,48.81 270 top
U4  46.27,29 180 top
U5  16.3,30.01 90 top
U$1  50.33,7.15 0 top
U$2  24.93,7.15 0 top

### Tracks (layer width: path | path; a pad name or v marks a point on that pad's centre or on a via)
3.3V  (via drill 0.3, 0.35, 0.38)
  Top 0.15: J3.P4 9.28,51.26 v9.44,51.09
  Top 0.152: 29.04,44.79 28.16,45.68 27.47,45.68 | 29.04,44.79 30.01,43.82 30.01,43.33 U1.49 30.04,42.95 30.44,42.55 | 25.95,46.64 25.95,45.76 26.03,45.68 27.47,45.68 | 27.47,45.68 C8.1 | 29.04,44.79 29.62,44.79 30.43,43.98 U1.48 30.44,42.55 | 30.44,42.47 30.44,42.55 | U1.44 32.04,44.73 32.3,45 32.78,45 33.01,45.23 | U1.43 32.44,44.37 32.81,44.75 34.56,44.75 34.89,45.08 | U1.1 v24.43,42.47 22.77,42.47 C6.1 | U1.10 v24.17,38.87 22.7,38.87 C34.1 | C27.2 9.27,33.66 v9.69,34.08 | U1.42 C11.1 36.33,43.36 v36.01,43.68 | U2.8 49.83,51.79 C18.1 49.81,52.61 v50.08,52.87 | LED1.4 53.27,54.96 C16.1 53.53,54.25 v53.89,53.89 | C22.1 50.69,50.16 51.02,50.49 U2.6 52.53,50.49 53.03,50.99 53.21,50.99 U2.2 | J2.2 | R16.2 R15.2 | C9.1 33.37,32.25 33.06,32.55 v31.28,32.55 31.03,32.81 31.03,33.57 30.78,33.82 30.37,33.82 30.04,34.16 U1.22 | U1.33 36.51,38.87 C5.1 36.55,37.95 v36.87,37.63 | R4.2 16.91,54.04 v16.8,54.14 | IC1.8 C17.1 | C17.1 23.25,49.15 v23.66,49.57
  Top 0.203: 30.44,42.47 v30.52,42.38 | 25.95,46.64 C7.1 | 33.01,45.23 33.42,45.63 C4.1 C10.1 | 34.89,45.08 C10.1 | C10.1 35.97,46.66 v36.11,46.52 | U4.P4 47.24,35.45 C28.1 47.27,36.97 C29.1 47.3,38.13 v47.03,38.4 | C19.1 52.16,44.11 52.52,44.47 52.52,44.75 52.9,45.13 J2.2 | J2.2 54.77,45.13 v55.16,44.75 | R6.2 R7.2 48.63,47.13 v48.23,47.54 | C22.1 49.79,49.36 v50.08,49.06 | U5.8 14.39,33.98 14.04,34.33 12.28,34.33 11.9,33.95 11.9,32.86 11.6,32.55 C27.2 | R15.2 6.29,30.67 v5.88,30.27
  Top 0.254: C17.1 | C15.2 44.76,47.64 U3.5 42.98,46.77 v43.48,46.27
  Route15 0.15: v9.44,51.09 9.44,50.59
  Route15 0.152: v24.43,42.47 24.42,42.46 23.66,42.46 | v24.17,38.87 25.15,38.87 25.19,38.9 | v36.01,43.68 35.3,43.68 35.27,43.65 | v50.08,52.87 50.84,52.87 | v31.28,32.55 32.05,32.55 | v36.87,37.63 37.38,37.63 37.63,37.38 | v53.89,53.89 54.31,53.89 54.34,53.86 | v16.8,54.14 16.8,54.91 | v23.66,49.57 24.68,49.57
  Route15 0.203: v30.52,42.38 31.28,42.38 | v47.03,38.4 45.76,38.4 | v55.16,44.75 55.92,44.75 | v48.23,47.54 48.23,48.23 48.3,48.3 | v50.08,49.06 50.84,49.06 | v5.88,30.27 5.88,29.51
  Route15 0.254: v43.48,46.27 44.49,46.27
  pour Route15: -5.8,27.98 -5.8,61.76 -2.5,65.06 61.51,65.06 66.59,59.98 66.59,32.05 64.05,29.51 37.63,29.51 37.12,29 33.82,25.7 27.47,25.7 24.93,28.24 18.33,28.24 11.98,28.24 10.2,26.46 -4.53,26.46 -5.8,27.73
!BOOT
  Top 0.152: S1.2 18.1,57.74 | 18.1,57.74 18.58,57.74 | 18.58,57.74 S1.1 | 18.09,57.75 18.1,57.74 | R5.2 18.38,54.19 18.84,54.65 18.84,57.48 18.58,57.74
!RESET  (via drill 0.38)
  Top 0.152: U1.26 31.63,37.12 v31.82,37.3 | S2.1 S2.2 40.39,57.74 v40.43,57.7
  Route2 0.152: v31.82,37.3 35.58,37.3 35.91,36.97 40.38,36.97 40.66,37.25 40.66,57.47 v40.43,57.7
CLK
  Top 0.15: 11.47,38.9 11.47,55.41 11.22,55.67 10.96,55.67 10.73,55.9 10.73,58.35 J3.P5
  Top 0.152: U1.17 28.04,35.4 27.75,35.12 24.65,35.12 24.2,35.58 24.2,36.85 23.89,37.15 12.35,37.15 11.47,38.03 11.47,38.9
CS  (via drill 0.3, 0.35)
  Top 0.15: v7.5,50.89 7.5,58.28 J3.P2
  Top 0.152: U1.12 27.15,38.07 v27.35,38.26
  Bottom 0.15: v7.5,50.89 7.78,50.61 8.96,50.61 9.46,50.11 9.46,49.92 9.59,49.79 9.59,39.74 9.79,39.54 25.06,39.54
  Bottom 0.152: v27.35,38.26 25.58,38.26 25.44,38.4 25.44,39.16 25.06,39.54
DATA1  (via drill 0.3, 0.35)
  Top 0.152: U1.14 24.56,37.27 24.12,37.71 13.93,37.71 13.5,38.14 v13.5,38.4 | J3.P8 14.03,50.86 v14.01,50.84
  Route2 0.152: v13.5,38.4 13.5,39.16 13.5,50.33 v14.01,50.84
DATA2  (via drill 0.3, 0.35)
  Top 0.15: v6.39,51.09 6.39,58.29 J3.P1
  Top 0.152: U1.13 25.03,37.67 v24.78,37.92
  Bottom 0.15: 9.18,37.89 9.16,37.91 9.16,49.93 8.91,50.18 6.52,50.18 6.34,50.36 6.34,51.04 v6.39,51.09
  Bottom 0.152: v24.78,37.92 14.3,37.92 14.01,37.63 9.44,37.63 9.18,37.89
GND  (via drill 0.38)
  Top 0.152: C21.1 30.33,28.65
  other vias: 19.35,38.65 20.62,53.63 27.47,39.92 48.55,42.71 24.17,31.28 45.51,30.78 39.92,36.11 23.92,55.92 52.62,48.81 53.63,31.28 57.45,46.02 12.23,50.84
  pour Top: -7.07,33.82 -7.07,61 -3.26,64.81 61,64.81 66.34,59.48 66.34,32.05 64.05,29.76 37.89,29.76 36.62,28.49 34.08,28.49 31.28,25.7 24.43,25.7 21.89,28.24 11.98,28.24 10.46,26.71 -4.78,26.71 -7.07,29
  pour Route2: -7.83,32.05 -7.83,60.24 -3.01,65.06 61,65.06 66.59,59.48 66.59,32.05 64.05,29.51 37.89,29.51 37.12,28.74 34.33,28.74 31.28,25.7 24.43,25.7 23.92,26.2 21.89,28.24 20.87,28.24 11.98,28.24 10.46,26.71 -4.78,26.71 -7.07,29
  pour Bottom (isolate 0.254): -7.83,32.05 -7.83,65.06 61,65.06 66.59,59.48 66.59,32.05 64.05,29.51 37.89,29.51 37.12,28.74 34.33,28.74 31.28,25.7 24.43,25.7 21.89,28.24 11.98,28.24 10.46,26.71 -4.78,26.71 -7.07,29
GND-ISO  (via drill 0.38)
  other vias: 7.66,19.6 36.11,19.85
  pour Top (rank 2): -1.99,-1.74 -1.99,24.68 2.33,29 11.47,29 12.99,30.52 62.52,30.52 62.52,0.55 60.49,-1.48 48.55,-1.48 46.52,0.55 46.52,5.88 46.27,6.14 33.31,6.14 32.05,4.87 32.05,-1.48 22.65,-1.48 22.39,-1.23 22.39,6.14 7.15,6.14 6.14,5.12 6.14,-2.5 6.9,-3.26 -0.47,-3.26
  pour Route2 (rank 2): -1.99,-1.74 -1.99,24.68 2.33,29 11.47,29 12.99,30.52 61.51,30.52 61.51,0.55 59.48,-1.48 48.55,-1.48 46.52,0.55 46.52,6.14 33.31,6.14 32.05,4.87 32.05,-1.48 22.65,-1.48 22.39,-1.23 22.39,6.14 7.15,6.14 6.14,5.12 6.14,-2.5 6.9,-3.26 -0.47,-3.26
  pour Bottom (rank 2): -1.99,-1.74 -1.99,24.68 2.33,29 11.47,29 12.99,30.52 63.03,30.52 63.03,0.55 61,-1.48 48.55,-1.48 46.52,0.55 46.52,6.14 33.31,6.14 32.05,4.87 32.05,-1.48 22.65,-1.48 22.39,-1.23 22.39,6.14 7.15,6.14 6.14,5.12 6.14,-2.5 6.9,-3.26 -0.47,-3.26
INT_MOD1  (via drill 0.35, 0.38)
  Top 0.152: v25.16,41.59 25.64,42.07 U1.2
  Top 0.203: v16.04,35.35 15.66,34.97 U5.7 15.71,32.43 15.71,30.98 15.41,30.67 R15.1
  Bottom 0.152: 25.7,36.11 25.82,36.24 25.95,36.36 28.49,36.36 28.74,36.62 28.74,41.59 28.26,42.08 25.65,42.08 v25.16,41.59
  Bottom 0.203: v16.04,35.35 24.93,35.35 25.82,36.24
INT_MOD1ISO
  Top 0.203: R18.1 14.37,19.24 14.77,18.84 22.65,18.84
  Top 0.381: U$2.P$7 23.93,4.85 23.41,5.38 23.41,18.08 22.65,18.84
INT_MOD2  (via drill 0.35, 0.38)
  Top 0.152: v29.18,42.08 28.11,42.08 27.7,41.67 U1.3
  Top 0.203: v17.31,34.59 16.93,34.2 U5.6 16.93,29.71 16.4,29.18 R16.1
  Bottom 0.152: 26.2,35.6 26.46,35.86 28.74,35.86 29,36.11 29,36.48 29.02,36.5 29.02,41.93 v29.18,42.08
  Bottom 0.203: v17.31,34.59 25.95,34.59 26.2,34.84 26.2,35.6
INT_MOD2ISO
  Top 0.203: 24.68,21.12 24.44,21.37 R17.1
  Top 0.381: U$1.P$7 53.65,4.85 53.13,5.38 53.13,17.82 52.62,18.33 25.7,18.33 25.19,18.84 25.19,20.62 24.68,21.12 | 18.32,21.45 R17.1
LED_R  (via drill 0.38)
  Top 0.152: U1.37 46.31,40.47 v46.52,40.68 | v46.52,53.38 46.52,54.89 R10.1
  Bottom 0.152: v46.52,40.68 v46.52,53.38
N$1
  Top 0.152: R10.2 48.1,56.72 D1.A
N$2
  Top 0.254: U4.P13 44.64,23.29 R9.1 R11.2
N$3
  Top 0.254: J1.A5 31.54,52.17 31.54,50.84 31.79,50.59 35.6,50.59 36.24,51.22 R3.2
N$4
  Top 0.152: R14.1 29.85,31.95 Q1.3 31.69,31.47 C20.2
N$5
  Top 0.203: R8.2 24.45,50.31 24.68,50.08 28.24,50.08 28.52,50.36 28.52,51.12
  Top 0.254: 28.52,51.12 J1.B5
N$6
  Top 0.152: R14.2 28.15,33.91 28.31,34.08 29.4,34.08 29.64,34.31 U1.21
N$7
  Top 0.203: R17.2 18.23,27.52 U5.4
N$8
  Top 0.203: R18.2 14.37,27.52 U5.1
N$9
  Top 0.254: J1.A4_B9 32.67,52.86 32.53,53 32.53,54.14 | 32.53,54.14 32.53,54.17 32.05,54.65 28.49,54.65 27.98,54.14 27.98,53.54 28,53.52 28,53 27.87,52.86 J1.B4_A9 | L1.1 41.12,52.4 C12.1 38.1,52.4 37.89,52.62 37.89,54.65 37.38,55.16 33.55,55.16 32.53,54.14
NEOPIXEL  (via drill 0.38)
  Top 0.152: U1.27 32.04,35.36 v32.3,35.09 | LED1.3 50.62,54.15 50.48,54.01 v49.83,54.01
  Route2 0.152: v32.3,35.09 49.32,35.09 49.83,35.6 49.83,47.54 49.43,47.94 49.43,53.62 v49.83,54.01
PDIS  (via drill 0.38)
  Top 0.152: U4.P8 44.64,35.96 v44.24,36.36 | v32.05,38.44 32.42,38.07 U1.31
  Bottom 0.152: v44.24,36.36 44.24,37.61 43.4,38.44 v32.05,38.44
PROBE
  Top 0.381: J4.1 12.23,4.36 12.9,5.03 18.76,5.03 U$2.P$4
PROBE2
  Top 0.381: J5.1 37.63,4.36 38.38,5.1 44.08,5.1 U$1.P$4
PROBE2_GND
  pour Top (rank 3): 32.3,-1.48 32.3,4.87 33.31,5.88 46.78,5.88 46.78,0.04 45.76,-0.98 32.81,-0.98
  pour Bottom (rank 3): 32.3,-1.74 32.3,4.87 33.31,5.88 46.52,5.88 46.52,-0.21 46.02,-0.72 33.31,-0.72
  pour Route2 (rank 3): 32.3,-1.48 32.3,4.87 33.31,5.88 46.78,5.88 47.03,5.63 47.03,0.29 45.76,-0.98 32.81,-0.98
PROBE_GND
  pour Top (rank 3): 6.39,-3.01 6.39,4.87 7.41,5.88 21.89,5.88 21.89,-3.01 21.63,-3.26 6.65,-3.26
  pour Route2 (rank 3): 6.39,-3.01 6.39,4.87 7.41,5.88 21.89,5.88 21.89,-3.01 21.63,-3.26 6.65,-3.26
  pour Bottom (rank 3): 6.39,-3.26 6.39,4.87 7.41,5.88 21.89,5.88 21.89,-3.01 21.63,-3.26
QSPI_CS
  Top 0.152: U1.56 20.11,43.3 19.6,42.8 19.6,40.17 19.35,39.92 12.74,39.92 12.49,40.17 12.49,48.81 12.82,49.15 15.53,49.15 | 15.53,49.15 IC1.1 | R5.1 R4.1 15.57,51.13 15.28,50.84 15.28,49.4 15.53,49.15
QSPI_SCLK
  Top 0.152: U1.52 28.81,43.33 28.81,43.82 27.8,44.84 25.03,44.84 24.76,44.57 22.34,44.57 22.09,44.82 22.09,47.39 21.93,47.55 IC1.6
QSPI_SD0
  Top 0.152: U1.53 28.41,43.33 28.41,43.82 27.68,44.56 25.23,44.56 24.96,44.29 21.83,44.29 21.63,44.49 21.63,46.55 21.43,46.75 IC1.5 20.77,46.78
QSPI_SD1
  Top 0.152: IC1.2 13.02,48.35 12.82,48.15 12.82,40.38 12.99,40.2 19.14,40.2 19.32,40.38 19.32,42.94 20.11,43.73 25.19,43.73 25.46,44 27.44,44 27.64,43.8 U1.55
QSPI_SD2
  Top 0.152: U1.54 28.04,43.8 27.56,44.28 25.34,44.28 25.07,44.01 19.85,44.01 19.04,43.2 19.04,40.68 18.84,40.48 13.3,40.48 13.1,40.68 13.1,47.21 13.43,47.55 IC1.3
QSPI_SD3
  Top 0.152: U1.51 29.21,43.33 29.21,43.82 27.92,45.12 24.91,45.12 24.64,44.85 22.7,44.85 22.55,45 22.55,47.79 22.01,48.33 21.98,48.33 21.96,48.34 IC1.7
SCL
  Top 0.152: J2.4 54.91,47.13 55.21,47.44 55.21,49.47 54.83,49.85 U2.4 | R7.1 51.16,48.24 50.94,48.45 49.42,48.45 49.06,48.81 47.79,48.81 47.54,48.55 47.54,41.95 47.79,41.7 49.83,41.7 50.08,41.44 50.08,31.03 49.57,30.52 49.06,30.52 48.54,31.04 U4.P2 48.54,38.15 47.65,39.05 44.63,39.05 44.24,38.65 44.24,37.38 43.98,37.12 37.28,37.12 37.14,36.98 36.51,36.98 35.82,37.67 U1.30
  Top 0.203: R7.1 J2.4
SCL_ISO  (via drill 0.35)
  Top 0.203: U4.P19 48.54,26.7 48.81,26.96 50.33,26.96 50.59,26.71 50.59,25.34 50.92,25.01 52.87,25.01 | 52.87,25.01 R13.1 52.87,24.82 | U$1.P$8 54.4,7.15 54.14,7.41 v54.14,13.25 54.14,22.65 53.63,23.16 53.38,23.16 53.13,23.41 53.13,24.76 52.87,25.01 | U$2.P$8 v34.84,7.15
  Route2 0.203: v54.14,13.25 35.35,13.25 35.09,12.99 35.09,7.41 v34.84,7.15
SDA
  Top 0.152: J2.3 55.28,46.13 55.67,46.52 | 55.67,46.52 55.67,49.83 55.05,50.44 54.63,50.44 54.59,50.49 U2.3 | U4.P3 47.89,30.67 | 55.67,46.52 56.18,46.02 56.18,42.71 55.92,42.46 50.59,42.46 50.36,42.23 50.36,30.91 49.69,30.24 48.33,30.24 47.89,30.67 | U1.29 35.46,37.27 35.86,36.87 35.86,30.27 36.11,30.01 47.23,30.01 47.89,30.67
  Top 0.203: J2.3 52.99,46.13 52.87,46.02 52.87,45.76 52.75,45.63 R6.1
SDA_ISO  (via drill 0.35)
  Top 0.203: U4.P18 48.04,25.55 48.04,26.67 48.67,27.3 50.47,27.3 51.16,26.61 R12.1 53.09,27.94 53.38,28.24 57.45,28.24 57.57,28.11 | 57.57,28.11 57.7,27.98 | 57.57,28.11 57.57,14.39 v57.19,14.01 | v24.43,13.25 33.06,13.25 33.57,12.74 33.57,11.98 33.8,11.75 U$1.P$1 44.36,11.72 46.52,11.72 46.78,11.98 46.78,13.76 47.03,14.01 v47.29,14.01 | v22.14,13.25 21.89,13.25 21.63,12.99 21.63,12.23 21.12,11.72 18.96,11.72 U$2.P$1
  Route2 0.203: v57.19,14.01 v47.29,14.01 | v24.43,13.25 v22.14,13.25
SDI
  Top 0.15: 12.23,36.87 8.98,36.87 8.45,37.4 8.45,58.28 J3.P3
  Top 0.152: U1.18 28.44,35.29 27.98,34.84 24.43,34.84 23.92,35.35 23.92,36.36 23.41,36.87 12.23,36.87
SDO
  Top 0.152: U1.15 27.24,35.87 26.96,35.6 24.73,35.6 24.48,35.86 24.48,36.96 24.01,37.43 12.94,37.43 12.74,37.63 12.74,38.75 12.51,38.98 12.18,38.98 11.95,39.21 11.95,49.44 12.21,49.7 12.41,49.7 12.92,50.21 J3.P7
SWCLK  (via drill 0.38)
  Top 0.152: U1.24 30.84,35.94 31.37,35.4 31.37,34.71 31.91,34.16 32.98,34.16 33.95,33.19 v34.28,33.19 | v55.07,53.18 55.07,53.8 55.23,53.97 TP1.TP
  Bottom 0.152: v34.28,33.19 49.7,33.19 50.08,33.57 50.08,48.05 50.33,48.3 51.6,48.3 51.92,48.3 52.09,48.13 53.21,48.13 53.38,48.3 56.43,48.3 56.68,48.55 56.68,52.87 56.38,53.18 v55.07,53.18
SWD  (via drill 0.38)
  Top 0.152: U1.25 31.26,36.41 31.26,35.91 31.65,35.52 31.65,34.82 32.03,34.44 34.22,34.44 v34.33,34.33 | v54.91,51.09 54.93,51.12 TP2.TP
  Bottom 0.152: v34.33,34.33 48.94,34.33 49.24,34.64 49.24,50.77 49.62,51.15 54.85,51.15 v54.91,51.09
SWITCH  (via drill 0.35, 0.38)
  Top 0.15: v10.1,50.18 10.1,56.94 9.98,57.06 J3.G1
  Top 0.152: U1.16 27.64,36.98 27.94,37.29 v27.94,37.3
  Route2 0.15: 11.47,37.2 10.38,37.2 9.97,37.61 9.97,50.06 v10.1,50.18
  Route2 0.152: 11.47,37.2 27.84,37.2 v27.94,37.3
USB_DM_IN
  Top 0.152: U1.46 31.24,44.79 30.52,45.51 30.52,46.56 R1.1
USB_DP_IN
  Top 0.152: U1.47 30.84,44.43 30.17,45.1 29.28,45.1 28.95,45.43 R2.1
USB_N
  Top 0.254: 30.02,50.84 30.02,50.82 29.96,50.76 29.96,49.88 30.42,49.42 R1.2 | 30.02,50.84 J1.A7 | J1.B7 31.02,51.84 30.99,51.82 30.99,51.48 30.8,51.29 30.47,51.29 30.02,50.84
USB_P
  Top 0.254: R2.2 28.95,49.37 29.58,50 29.58,50.43 29.52,50.48 J1.B6 29.51,52.2 29.51,53.38 29.76,53.63 30.27,53.63 30.52,53.38 J1.A6
V_USB  (via drill 0.38)
  Top 0.203: U4.P9 43.99,31.29 43.48,30.78 41.61,30.78 C23.1 C25.1 39.02,30.92 v38.65,31.28 | v43.98,52.62 43.73,52.37 42.87,52.37 L1.2 | U3.3 41.08,50.98 41.44,51.35 42.71,51.35
  Top 0.254: C14.2 C13.1 43.06,49.89 U3.1 42.98,51.09 42.71,51.35 42.71,52.36 L1.2
  Route15 0.203: v38.65,31.28 38.65,51.86 39.16,52.37 43.73,52.37 v43.98,52.62
VCC-ISO  (via drill 0.35, 0.38)
  Top 0.152: U4.P17 47.24,23.2 C30.1 C26.1 47.2,20.2 v47.54,19.85
  Top 0.203: R12.2 54.79,25.04 R13.2 56.1,25.01 v56.43,24.68 | U$1.P$3 44.46,7.43
  Top 0.254: U4.P12 43.99,26.98 43.67,27.31 C24.1 C31.1 38.48,27.31 v38.14,26.96 | R9.2 41.75,23.1 v41.44,23.41
  Top 0.381: U$2.P$3 15.65,7.15 C32.1 15.62,8.33 v15.28,8.68 | U$1.P$3 41.51,7.15 C33.1 41.48,8.64 40.94,9.18 v40.68,9.18
  Route15 0.152: v47.54,19.85 48.05,19.85 48.3,19.6
  Route15 0.203: v56.43,24.68 56.43,23.92
  Route15 0.254: v38.14,26.96 38.14,25.95 | v41.44,23.41 40.94,23.41 40.68,23.66
  Route15 0.381: v15.28,8.68 14.01,8.68 | v40.68,9.18 39.16,9.18
  pour Route15 (rank 2): -1.99,-2.25 -1.99,24.68 0.04,26.71 10.71,26.71 11.98,27.98 35.86,27.98 37.12,29.25 63.29,29.25 63.8,28.74 63.8,-0.98 63.29,-1.48 48.55,-1.48 46.52,0.55 46.52,6.14 33.31,6.14 32.05,4.87 32.05,-1.48 22.65,-1.48 22.39,-1.23 22.39,6.14 7.15,6.14 6.14,5.12 6.14,-3.01 5.88,-3.26 -0.98,-3.26
VOUT  (via drill 0.3, 0.38)
  Top 0.152: U1.50 29.61,43.33 29.61,43.82 28.04,45.4 24.69,45.4 24.48,45.61 C3.1 23.3,46.66 23.16,46.52 v23.16,46.02 | U1.45 31.63,45.05 | U1.23 30.45,36.42 30.45,34.59 | 30.45,34.55 30.45,34.59 | 30.45,34.59 v30.67,34.59 | v30.67,34.59 v30.69,34.59 | C2.1 34.86,32.25 34.56,32.55 34.55,32.54 34.01,32.54 33.56,32.98 32.27,32.98 v30.67,34.59
  Top 0.203: 31.63,45.05 31.89,45.3 v31.89,45.51 C1.1
  Route15 0.152: v31.89,45.51 29.51,45.51 | 29.51,45.51 23.41,45.51 23.16,45.76 v23.16,46.02 | v30.69,34.59 30.69,41.3 29.87,42.11 29.87,45.14 29.51,45.51
XIN
  Top 0.152: C21.2 28.61,28.41 28.59,28.39 27.24,28.39 26.89,28.74 26.89,30.17 | 26.89,30.17 26.89,33.98 27.32,34.41 29.05,34.41 29.24,34.59 U1.20 | Q1.1 27.18,29.87 26.89,30.17

### Text on the board
tNames: RST | GND | BOOT | SWCLK | SWD